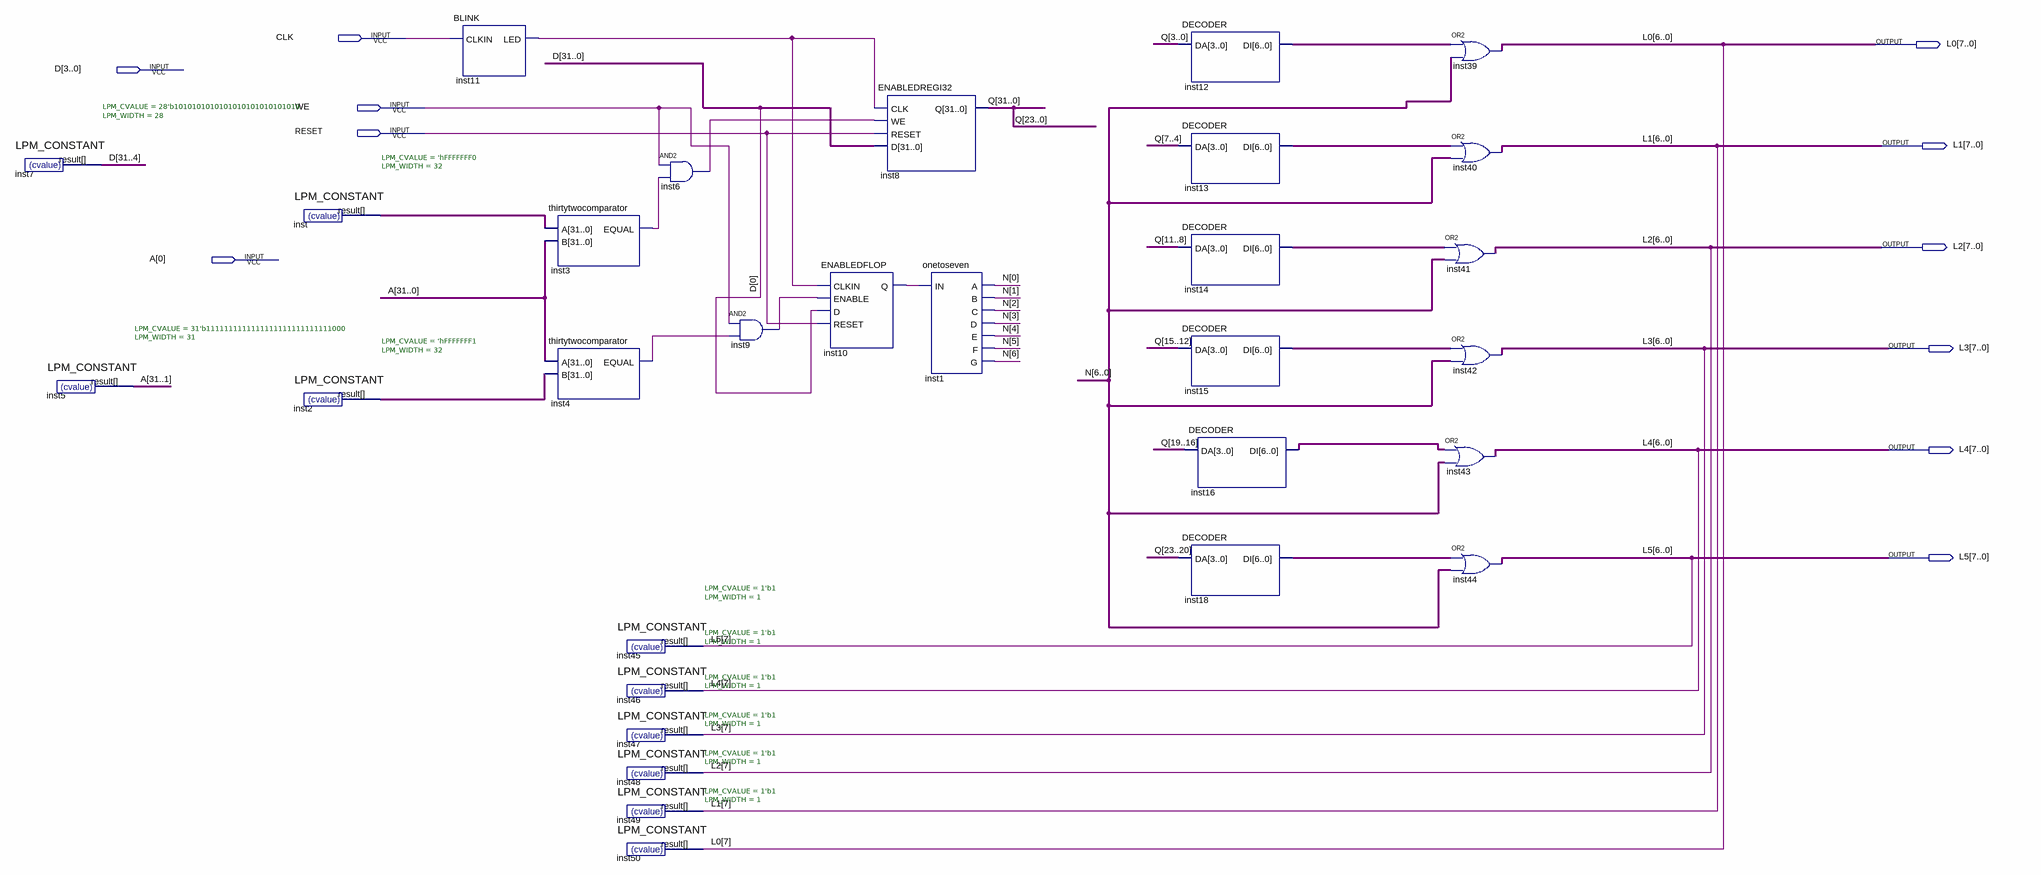
[diagram p0: schematic sheet]
// Quartus schematic displaydrivertwo.bdf as structural Verilog: 30 symbols, 11 pins
module displaydrivertwo (
  input  CLK,
  input  [31:0] D,
  input  WE,
  input  RESET,
  input  [31:0] A,
  output [7:0] L0,
  output [7:0] L1,
  output [7:0] L2,
  output [7:0] L3,
  output [7:0] L4,
  output [7:0] L5
);

  wire inst3_equal, inst4_equal, inst6_out, inst9_out, inst10_q, inst11_led;
  wire [6:0] inst12_di, inst13_di, inst14_di, inst15_di, inst16_di, inst18_di, N;
  wire [31:0] inst2_result, inst_result, Q;

  LPM_CONSTANT #(.LPM_CVALUE(28'b1010101010101010101010101010), .LPM_WIDTH(28)) inst7 (.result(D[31:4]));
  LPM_CONSTANT #(.LPM_CVALUE(31'b1111111111111111111111111111000), .LPM_WIDTH(31)) inst5 (.result(A[31:1]));
  LPM_CONSTANT #(.LPM_CVALUE('hFFFFFFF0), .LPM_WIDTH(32)) inst (.result(inst_result));
  LPM_CONSTANT #(.LPM_CVALUE('hFFFFFFF1), .LPM_WIDTH(32)) inst2 (.result(inst2_result));
  BLINK inst11 (.CLKIN(CLK), .LED(inst11_led));
  thirtytwocomparator inst3 (.A(inst_result), .B(A), .EQUAL(inst3_equal));
  thirtytwocomparator inst4 (.A(A), .B(inst2_result), .EQUAL(inst4_equal));
  LPM_CONSTANT #(.LPM_CVALUE(1'b1), .LPM_WIDTH(1)) inst45 (.result(L5[7]));
  LPM_CONSTANT #(.LPM_CVALUE(1'b1), .LPM_WIDTH(1)) inst46 (.result(L4[7]));
  LPM_CONSTANT #(.LPM_CVALUE(1'b1), .LPM_WIDTH(1)) inst47 (.result(L3[7]));
  LPM_CONSTANT #(.LPM_CVALUE(1'b1), .LPM_WIDTH(1)) inst48 (.result(L2[7]));
  LPM_CONSTANT #(.LPM_CVALUE(1'b1), .LPM_WIDTH(1)) inst49 (.result(L1[7]));
  LPM_CONSTANT #(.LPM_CVALUE(1'b1), .LPM_WIDTH(1)) inst50 (.result(L0[7]));
  and inst6 (inst6_out, WE, inst3_equal);
  and inst9 (inst9_out, WE, inst4_equal);
  ENABLEDFLOP inst10 (.CLKIN(inst11_led), .ENABLE(inst9_out), .D(D[0]), .RESET(RESET), .Q(inst10_q));
  ENABLEDREGI32 inst8 (.CLK(inst11_led), .WE(inst6_out), .RESET(RESET), .D(D), .Q(Q));
  onetoseven inst1 (.IN(inst10_q), .A(N[0]), .B(N[1]), .C(N[2]), .D(N[3]), .E(N[4]), .F(N[5]), .G(N[6]));
  DECODER inst12 (.DA(Q[3:0]), .DI(inst12_di));
  DECODER inst13 (.DA(Q[7:4]), .DI(inst13_di));
  DECODER inst14 (.DA(Q[11:8]), .DI(inst14_di));
  DECODER inst15 (.DA(Q[15:12]), .DI(inst15_di));
  DECODER inst16 (.DA(Q[19:16]), .DI(inst16_di));
  DECODER inst18 (.DA(Q[23:20]), .DI(inst18_di));
  assign L2[6:0] = inst14_di | N;  // OR2 inst41, 7 bits wide
  assign L4[6:0] = inst16_di | N;  // OR2 inst43, 7 bits wide
  assign L0[6:0] = inst12_di | N;  // OR2 inst39, 7 bits wide
  assign L1[6:0] = inst13_di | N;  // OR2 inst40, 7 bits wide
  assign L3[6:0] = inst15_di | N;  // OR2 inst42, 7 bits wide
  assign L5[6:0] = inst18_di | N;  // OR2 inst44, 7 bits wide
endmodule
